# Altium schematic sheet PCB_DYBoard_Collector_V1_Sh2.SchDoc
size A4; SheetNumber: 2; SheetTotal: 3
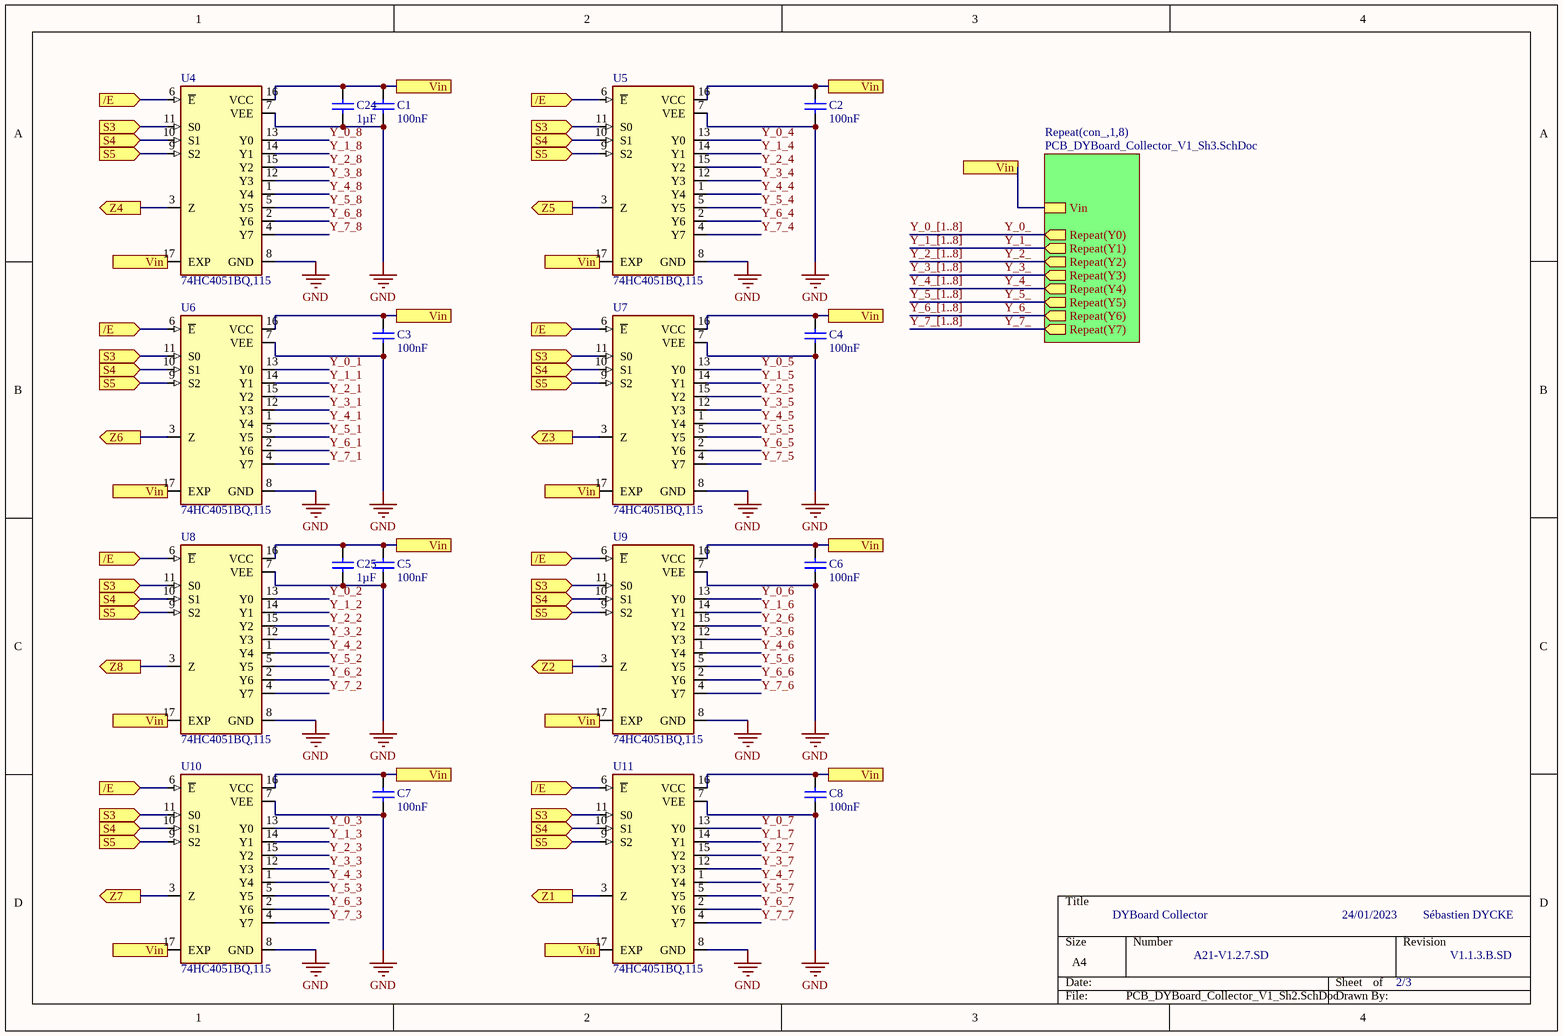
[diagram p0: PCB_DYBoard_Collector_V1_Sh2.SchDoc]

## Parts
C1  value 100nF  [1608[0603]]  (hidden comment: Cap Semi)
C2  value 100nF  [1608[0603]]  (hidden comment: Cap Semi)
C3  value 100nF  [1608[0603]]  (hidden comment: Cap Semi)
C4  value 100nF  [1608[0603]]  (hidden comment: Cap Semi)
C5  value 100nF  [1608[0603]]  (hidden comment: Cap Semi)
C6  value 100nF  [1608[0603]]  (hidden comment: Cap Semi)
C7  value 100nF  [1608[0603]]  (hidden comment: Cap Semi)
C8  value 100nF  [1608[0603]]  (hidden comment: Cap Semi)
C24  value 1µF  [1608[0603]]  (hidden comment: Cap Semi)
C25  value 1µF  [1608[0603]]  (hidden comment: Cap Semi)
U4  74HC4051BQ,115  [QFN50P250X350X100-17N]
U5  74HC4051BQ,115  [QFN50P250X350X100-17N]
U6  74HC4051BQ,115  [QFN50P250X350X100-17N]
U7  74HC4051BQ,115  [QFN50P250X350X100-17N]
U8  74HC4051BQ,115  [QFN50P250X350X100-17N]
U9  74HC4051BQ,115  [QFN50P250X350X100-17N]
U10  74HC4051BQ,115  [QFN50P250X350X100-17N]
U11  74HC4051BQ,115  [QFN50P250X350X100-17N]

## Sub-sheets
Repeat(con_,1,8) = PCB_DYBoard_Collector_V1_Sh3.SchDoc: Vin, Repeat(Y0) (out), Repeat(Y1) (out), Repeat(Y2) (out), Repeat(Y3) (out), Repeat(Y4) (out), Repeat(Y5) (out), Repeat(Y6) (out), Repeat(Y7) (out)

## Ports
/E (in, see PCB_DYBoard_Collector_V1_Sh1[4C]), S3 (in, see PCB_DYBoard_Collector_V1_Sh1[4C]), S4 (in, see PCB_DYBoard_Collector_V1_Sh1[4C]), S5 (in, see PCB_DYBoard_Collector_V1_Sh1[4C]), Vin (see PCB_DYBoard_Collector_V1_Sh1[4B], PCB_DYBoard_Collector_V1_Sh3[1C], PCB_DYBoard_Collector_V1_Sh3[2B], PCB_DYBoard_Collector_V1_Sh3[2C], PCB_DYBoard_Collector_V1_Sh3[3C], PCB_DYBoard_Collector_V1_Sh3[4B], PCB_DYBoard_Collector_V1_Sh3[4C]), Z1 (out, see PCB_DYBoard_Collector_V1_Sh1[4C]), Z2 (out, see PCB_DYBoard_Collector_V1_Sh1[4C]), Z3 (out, see PCB_DYBoard_Collector_V1_Sh1[4C]), Z4 (out, see PCB_DYBoard_Collector_V1_Sh1[4C]), Z5 (out, see PCB_DYBoard_Collector_V1_Sh1[4C]), Z6 (out, see PCB_DYBoard_Collector_V1_Sh1[4C]), Z7 (out, see PCB_DYBoard_Collector_V1_Sh1[4C]), Z8 (out, see PCB_DYBoard_Collector_V1_Sh1[4C])

## Nets
GND: C1.1 C2.1 C3.1 C4.1 C5.1 C6.1 C7.1 C8.1 C24.1 C25.1 U4.7(VEE) U4.8(GND) U5.7(VEE) U5.8(GND) U6.7(VEE) U6.8(GND) U7.7(VEE) U7.8(GND) U8.7(VEE) U8.8(GND) U9.7(VEE) U9.8(GND) U10.7(VEE) U10.8(GND) U11.7(VEE) U11.8(GND)
/E: U4.6(~{E}) U5.6(~{E}) U6.6(~{E}) U7.6(~{E}) U8.6(~{E}) U9.6(~{E}) U10.6(~{E}) U11.6(~{E}) ; port /E
S3: U4.11(S0) U5.11(S0) U6.11(S0) U7.11(S0) U8.11(S0) U9.11(S0) U10.11(S0) U11.11(S0) ; port S3
S4: U4.10(S1) U5.10(S1) U6.10(S1) U7.10(S1) U8.10(S1) U9.10(S1) U10.10(S1) U11.10(S1) ; port S4
S5: U4.9(S2) U5.9(S2) U6.9(S2) U7.9(S2) U8.9(S2) U9.9(S2) U10.9(S2) U11.9(S2) ; port S5
Vin: C1.2 C2.2 C3.2 C4.2 C5.2 C6.2 C7.2 C8.2 C24.2 C25.2 U4.16(VCC) U4.17(EXP) U5.16(VCC) U5.17(EXP) U6.16(VCC) U6.17(EXP) U7.16(VCC) U7.17(EXP) U8.16(VCC) U8.17(EXP) U9.16(VCC) U9.17(EXP) U10.16(VCC) U10.17(EXP) U11.16(VCC) U11.17(EXP) ; port Vin, sheet Repeat(con_,1,8)/Vin
Y_0_: sheet Repeat(con_,1,8)/Repeat(Y0)
Y_0_1: U6.13(Y0)
Y_0_2: U8.13(Y0)
Y_0_3: U10.13(Y0)
Y_0_4: U5.13(Y0)
Y_0_5: U7.13(Y0)
Y_0_6: U9.13(Y0)
Y_0_7: U11.13(Y0)
Y_0_8: U4.13(Y0)
Y_1_: sheet Repeat(con_,1,8)/Repeat(Y1)
Y_1_1: U6.14(Y1)
Y_1_2: U8.14(Y1)
Y_1_3: U10.14(Y1)
Y_1_4: U5.14(Y1)
Y_1_5: U7.14(Y1)
Y_1_6: U9.14(Y1)
Y_1_7: U11.14(Y1)
Y_1_8: U4.14(Y1)
Y_2_: sheet Repeat(con_,1,8)/Repeat(Y2)
Y_2_1: U6.15(Y2)
Y_2_2: U8.15(Y2)
Y_2_3: U10.15(Y2)
Y_2_4: U5.15(Y2)
Y_2_5: U7.15(Y2)
Y_2_6: U9.15(Y2)
Y_2_7: U11.15(Y2)
Y_2_8: U4.15(Y2)
Y_3_: sheet Repeat(con_,1,8)/Repeat(Y3)
Y_3_1: U6.12(Y3)
Y_3_2: U8.12(Y3)
Y_3_3: U10.12(Y3)
Y_3_4: U5.12(Y3)
Y_3_5: U7.12(Y3)
Y_3_6: U9.12(Y3)
Y_3_7: U11.12(Y3)
Y_3_8: U4.12(Y3)
Y_4_: sheet Repeat(con_,1,8)/Repeat(Y4)
Y_4_1: U6.1(Y4)
Y_4_2: U8.1(Y4)
Y_4_3: U10.1(Y4)
Y_4_4: U5.1(Y4)
Y_4_5: U7.1(Y4)
Y_4_6: U9.1(Y4)
Y_4_7: U11.1(Y4)
Y_4_8: U4.1(Y4)
Y_5_: sheet Repeat(con_,1,8)/Repeat(Y5)
Y_5_1: U6.5(Y5)
Y_5_2: U8.5(Y5)
Y_5_3: U10.5(Y5)
Y_5_4: U5.5(Y5)
Y_5_5: U7.5(Y5)
Y_5_6: U9.5(Y5)
Y_5_7: U11.5(Y5)
Y_5_8: U4.5(Y5)
Y_6_: sheet Repeat(con_,1,8)/Repeat(Y6)
Y_6_1: U6.2(Y6)
Y_6_2: U8.2(Y6)
Y_6_3: U10.2(Y6)
Y_6_4: U5.2(Y6)
Y_6_5: U7.2(Y6)
Y_6_6: U9.2(Y6)
Y_6_7: U11.2(Y6)
Y_6_8: U4.2(Y6)
Y_7_: sheet Repeat(con_,1,8)/Repeat(Y7)
Y_7_1: U6.4(Y7)
Y_7_2: U8.4(Y7)
Y_7_3: U10.4(Y7)
Y_7_4: U5.4(Y7)
Y_7_5: U7.4(Y7)
Y_7_6: U9.4(Y7)
Y_7_7: U11.4(Y7)
Y_7_8: U4.4(Y7)
Z1: U11.3(Z) ; port Z1
Z2: U9.3(Z) ; port Z2
Z3: U7.3(Z) ; port Z3
Z4: U4.3(Z) ; port Z4
Z5: U5.3(Z) ; port Z5
Z6: U6.3(Z) ; port Z6
Z7: U10.3(Z) ; port Z7
Z8: U8.3(Z) ; port Z8

## Buses and harness runs
bus Y_0_[1..8]
bus Y_1_[1..8]
bus Y_2_[1..8]
bus Y_3_[1..8]
bus Y_4_[1..8]
bus Y_5_[1..8]
bus Y_6_[1..8]
bus Y_7_[1..8]

## Notes on the sheet
- DYBoard Collector
- 24/01/2023
- Sébastien DYCKE
- A21-V1.2.7.SD
- 2/3
- V1.1.3.B.SD

## Library data of the parts
C1-C8 C24 C25 = Cap Semi: Capacitor (Semiconductor SIM Model); Published: 8-Jun-2000; LatestRevisionDate: 29-May-2009; LatestRevisionNote: IPC-7351 Footprint Added.; PackageReference: C1206; Publisher: Altium Limited; PackageDescription: Chip Capacitor
U4-U11 = 74HC4051BQ,115: 1 Circuit IC Switch 8:1 120Ohm 16-DHVQFN _2.5x3.5_; MF: Nexperia USA; Value: *; SnapEDA_Link: https://www.snapeda.com/parts/74HC4051BQ%2C115/Nexperia%20USA%20Inc./view-part/523294/?ref=snap; Availability: Unavailable; MP: 74HC4051BQ,115; Package: DHVQFN-16 NXP Semiconductors; Price: None